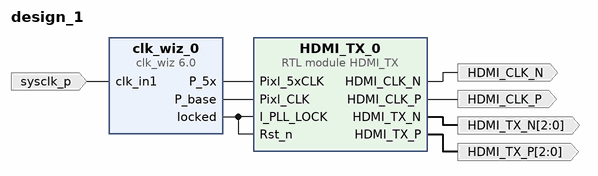
[diagram p0: block diagram of the top level]
# Vivado block design design_1, xc7z020clg484-1, Vivado 2022.2
create_bd_design design_1

create_bd_port -dir O -type clk HDMI_CLK_P
create_bd_port -dir O -type clk HDMI_CLK_N
create_bd_port -dir O -from 2 -to 0 HDMI_TX_P
create_bd_port -dir O -from 2 -to 0 HDMI_TX_N
create_bd_port -dir I -type clk sysclk_p

create_bd_cell -type ip -vlnv xilinx.com:ip:clk_wiz:6.0 clk_wiz_0
set_property -dict [list \
  CONFIG.CLKOUT1_JITTER 128.710 \
  CONFIG.CLKOUT1_PHASE_ERROR 91.100 \
  CONFIG.CLKOUT1_REQUESTED_OUT_FREQ 75 \
  CONFIG.CLKOUT2_JITTER 95.380 \
  CONFIG.CLKOUT2_PHASE_ERROR 91.100 \
  CONFIG.CLKOUT2_REQUESTED_OUT_FREQ 375 \
  CONFIG.CLKOUT2_USED true \
  CONFIG.CLK_OUT1_PORT P_base \
  CONFIG.CLK_OUT2_PORT P_5x \
  CONFIG.MMCM_CLKFBOUT_MULT_F 11.250 \
  CONFIG.MMCM_CLKOUT0_DIVIDE_F 15.000 \
  CONFIG.MMCM_CLKOUT1_DIVIDE 3 \
  CONFIG.MMCM_DIVCLK_DIVIDE 1 \
  CONFIG.NUM_OUT_CLKS 2 \
  CONFIG.USE_RESET false \
] [get_bd_cells clk_wiz_0]
create_bd_cell -type module -reference HDMI_TX HDMI_TX_0

# ---- connections ----

connect_bd_net [get_bd_pins HDMI_TX_0/HDMI_CLK_N] [get_bd_ports HDMI_CLK_N]
connect_bd_net [get_bd_pins HDMI_TX_0/HDMI_CLK_P] [get_bd_ports HDMI_CLK_P]
connect_bd_net [get_bd_pins HDMI_TX_0/HDMI_TX_N] [get_bd_ports HDMI_TX_N]
connect_bd_net [get_bd_pins HDMI_TX_0/HDMI_TX_P] [get_bd_ports HDMI_TX_P]
connect_bd_net -net clk_in1_0_1 [get_bd_ports sysclk_p] [get_bd_pins clk_wiz_0/clk_in1]
connect_bd_net [get_bd_pins clk_wiz_0/P_5x] [get_bd_pins HDMI_TX_0/Pixl_5xCLK]
connect_bd_net [get_bd_pins clk_wiz_0/P_base] [get_bd_pins HDMI_TX_0/Pixl_CLK]
connect_bd_net [get_bd_pins clk_wiz_0/locked] [get_bd_pins HDMI_TX_0/Rst_n] [get_bd_pins HDMI_TX_0/I_PLL_LOCK]

validate_bd_design
save_bd_design
